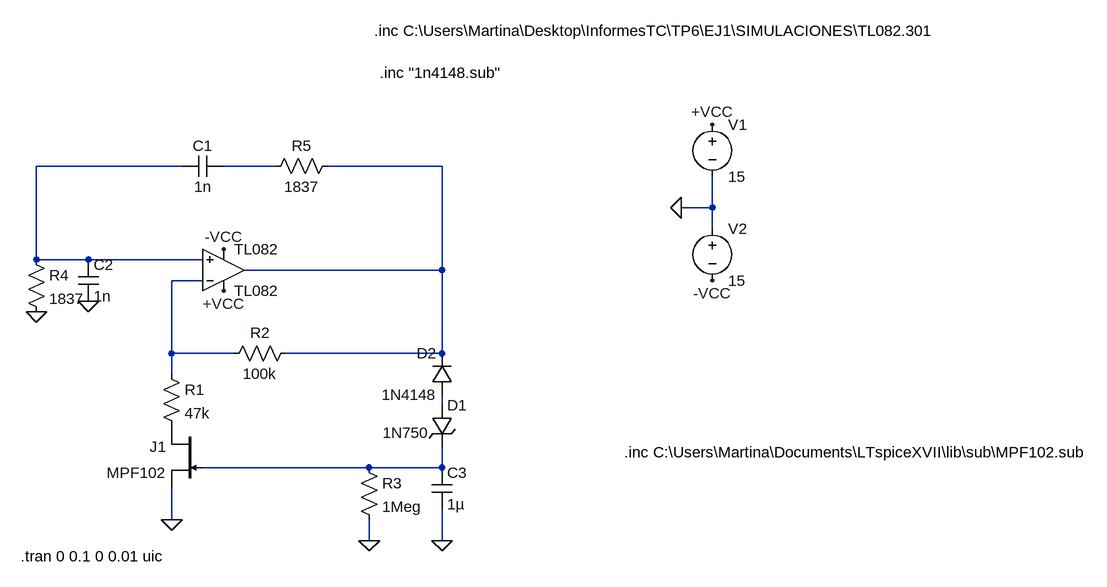
[diagram p0: schematic WIEN.asc]
WIEN.asc, the LTspice schematic file:
Version 4
SHEET 1 1488 696
WIRE 64 80 -160 80
WIRE 208 80 128 80
WIRE 464 80 288 80
WIRE 880 144 880 96
WIRE 880 144 832 144
WIRE 880 176 880 144
WIRE -160 224 -160 80
WIRE -80 224 -160 224
WIRE 96 224 -80 224
WIRE 464 240 464 80
WIRE 464 240 160 240
WIRE 96 256 48 256
WIRE 48 368 48 256
WIRE 144 368 48 368
WIRE 464 368 464 240
WIRE 464 368 224 368
WIRE 48 400 48 368
WIRE 464 448 464 432
WIRE 352 544 96 544
WIRE 464 544 464 512
WIRE 464 544 352 544
WIRE 48 624 48 576
WIRE 352 656 352 624
WIRE 464 656 464 608
FLAG 352 656 0
FLAG 464 656 0
FLAG 48 624 0
FLAG -160 304 0
FLAG -80 288 0
FLAG 832 144 0
FLAG 880 16 +VCC
FLAG 128 272 +VCC
FLAG 880 256 -VCC
FLAG 128 208 -VCC
SYMBOL Opamps\\opamp2 128 304 M180
SYMATTR InstName TL082
SYMATTR Value TL082
SYMBOL cap 128 64 R90
WINDOW 0 0 32 VBottom 2
WINDOW 3 32 32 VTop 2
SYMATTR InstName C1
SYMATTR Value 1n
SYMBOL cap -96 224 R0
SYMATTR InstName C2
SYMATTR Value 1n
SYMBOL cap 448 544 R0
SYMATTR InstName C3
SYMATTR Value 1µ
SYMBOL res 32 384 R0
SYMATTR InstName R1
SYMATTR Value 47k
SYMBOL res 240 352 R90
WINDOW 0 0 56 VBottom 2
WINDOW 3 32 56 VTop 2
SYMATTR InstName R2
SYMATTR Value 100k
SYMBOL res 336 528 R0
SYMATTR InstName R3
SYMATTR Value 1Meg
SYMBOL res -176 208 R0
SYMATTR InstName R4
SYMATTR Value 1837
SYMBOL zener 448 448 R0
WINDOW 3 -75 42 Left 2
SYMATTR Value 1N750
SYMATTR InstName D1
SYMBOL diode 480 432 R180
WINDOW 0 24 64 Left 2
WINDOW 3 24 0 Left 2
SYMATTR InstName D2
SYMATTR Value 1N4148
SYMBOL njf 96 480 M0
SYMATTR InstName J1
SYMATTR Value MPF102
SYMBOL res 304 64 R90
WINDOW 0 0 56 VBottom 2
WINDOW 3 32 56 VTop 2
SYMATTR InstName R5
SYMATTR Value 1837
SYMBOL voltage 880 0 R0
SYMATTR InstName V1
SYMATTR Value 15
SYMBOL voltage 880 160 R0
SYMATTR InstName V2
SYMATTR Value 15
TEXT 360 -128 Left 2 !.inc C:\\Users\\Martina\\Desktop\\InformesTC\\TP6\\EJ1\\SIMULACIONES\\TL082.301
TEXT -184 680 Left 2 !.tran 0 0.1 0 0.01 uic
TEXT 368 -64 Left 2 !.inc "1n4148.sub"
TEXT 744 520 Left 2 !.inc C:\\Users\\Martina\\Documents\\LTspiceXVII\\lib\\sub\\MPF102.sub

The netlist it stands for:
* WIEN.asc
XTL082 N001 N004 +VCC -VCC N003 TL082  ; pins In+ In- V+ V- OUT
C1 N002 N001 1n
C2 N001 0 1n
C3 N006 0 1µ
R1 N004 P001 47k
R2 N003 N004 100k
R3 N006 0 1Meg
R4 N001 0 1837
D1 N005 N006 1N750
D2 N005 N003 1N4148
J1 P001 N006 0 MPF102
R5 N003 N002 1837
V1 +VCC 0 15
V2 0 -VCC 15
.model D D
.lib standard.dio
.model NJF NJF
.model PJF PJF
.lib standard.jft
.inc C:\Users\Martina\Desktop\InformesTC\TP6\EJ1\SIMULACIONES\TL082.301
.tran 0 0.1 0 0.01 uic
.inc "1n4148.sub"
.inc C:\Users\Martina\Documents\LTspiceXVII\lib\sub\MPF102.sub
.backanno
.end